# EAGLE design xover (EAGLE 6.4)
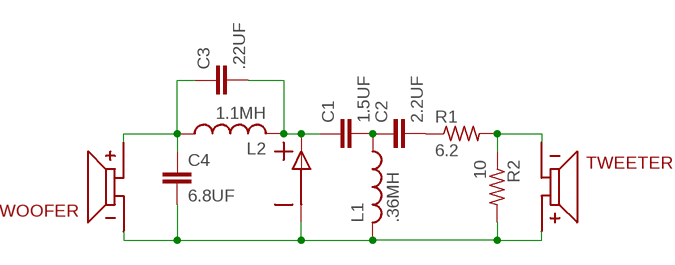
[diagram p0: schematic, sheet 1]

## Parts
C1  1.5UF  [1.5UF]
C2  2.2UF  [2.2UF]
C3  .22UF  [.22UF]
C4  6.8UF  [6.8UF]
INPUT  INPUTREV  [SCREW]
L1  .36MH  .36MHVERTREV  [.36VERT]
L2  1.1MH  1.1MHREV  [1.1MH]
R1  6.2  [6.2]
R2  10  6.210  [6.2]
TWEETER  TWEETER  [SCREW]
WOOFER  TWEETER  [SCREW]

## Nets
N$1: C1.P$1 C3.P$2 INPUT.P$1(PLUS) L2.P$1
N$2: C2.P$2 R1.P$1
N$3: C3.P$1 C4.P$1 L2.P$2 WOOFER.P$2(PLUS)
N$4: R1.P$2 R2.P$1 TWEETER.P$1(MINUS)
N$5: C4.P$2 INPUT.P$2(MINUS) L1.P$1 R2.P$2 TWEETER.P$2(PLUS) WOOFER.P$1(MINUS)
N$7: C1.P$2 C2.P$1 L1.P$2

## Library data of the parts
C1 = xover:1.5UF
C2 = xover:2.2UF
C3 = xover:.22UF
C4 = xover:6.8UF
INPUT = xover:INPUT
L1 = xover:.36MH
L2 = xover:1.1MH
R1 R2 = xover:6.2
TWEETER WOOFER = xover:TWEETER

## Board
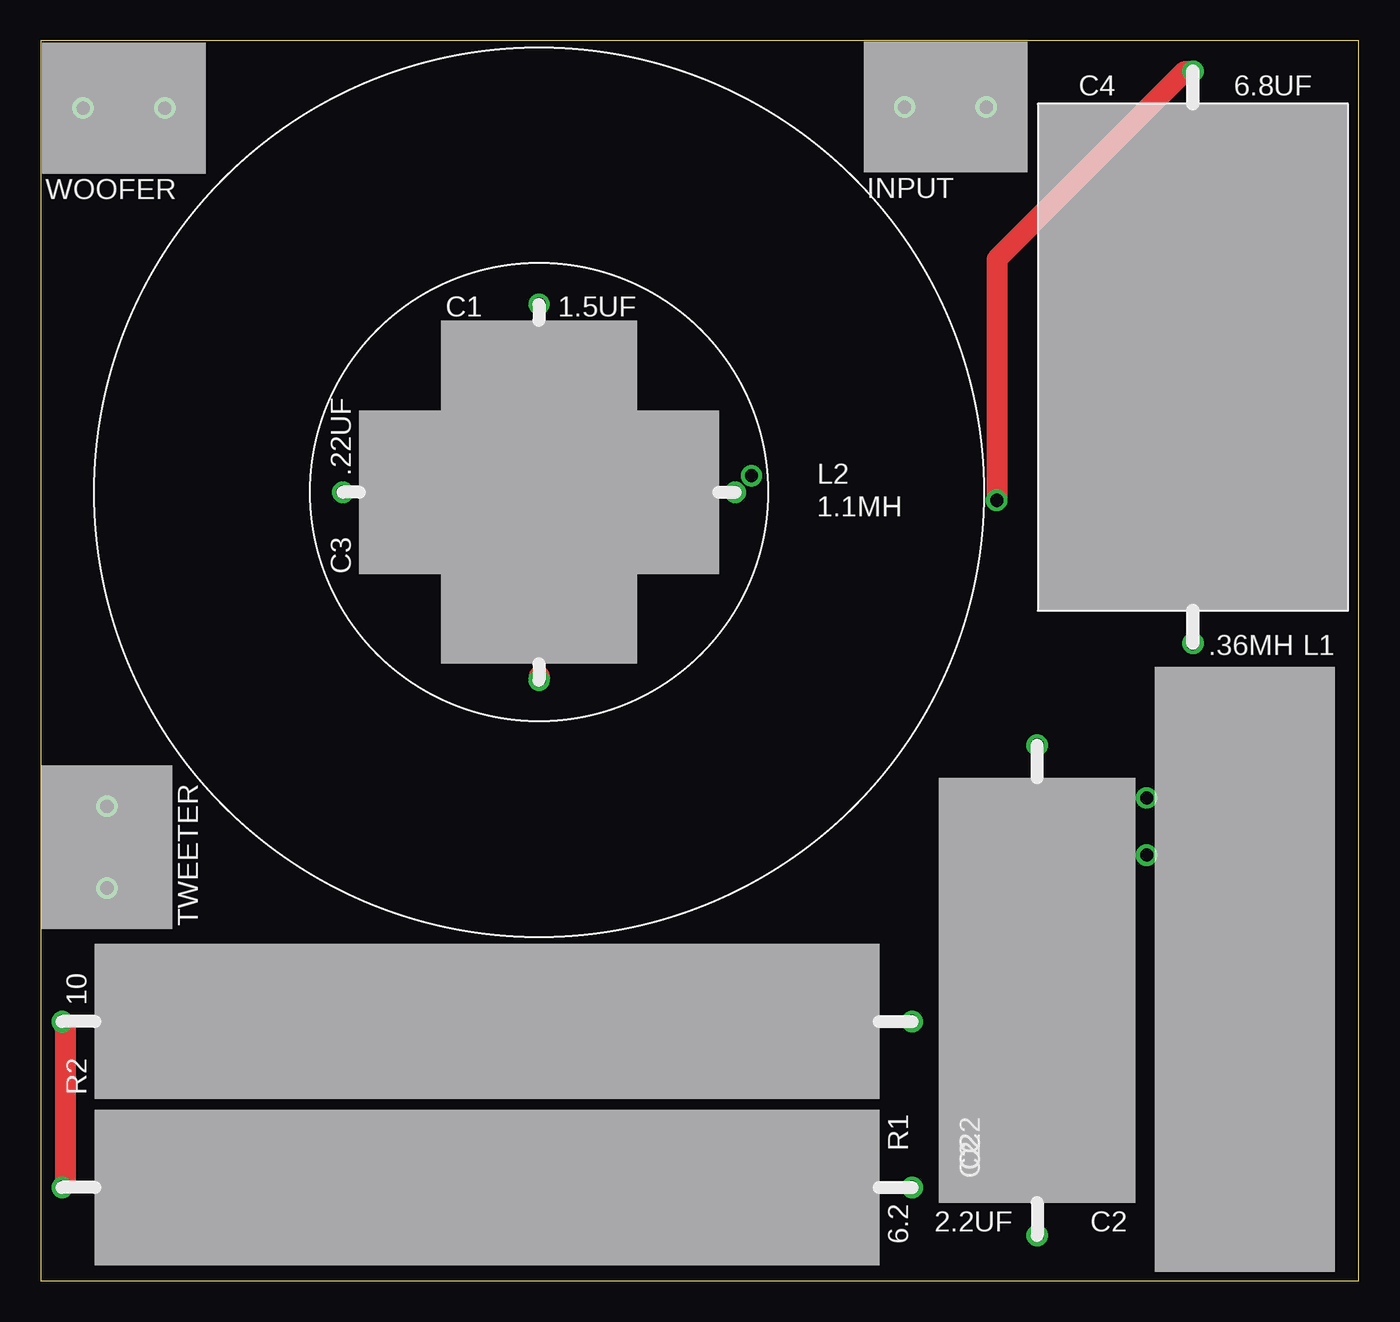
[diagram p1: board, top side]
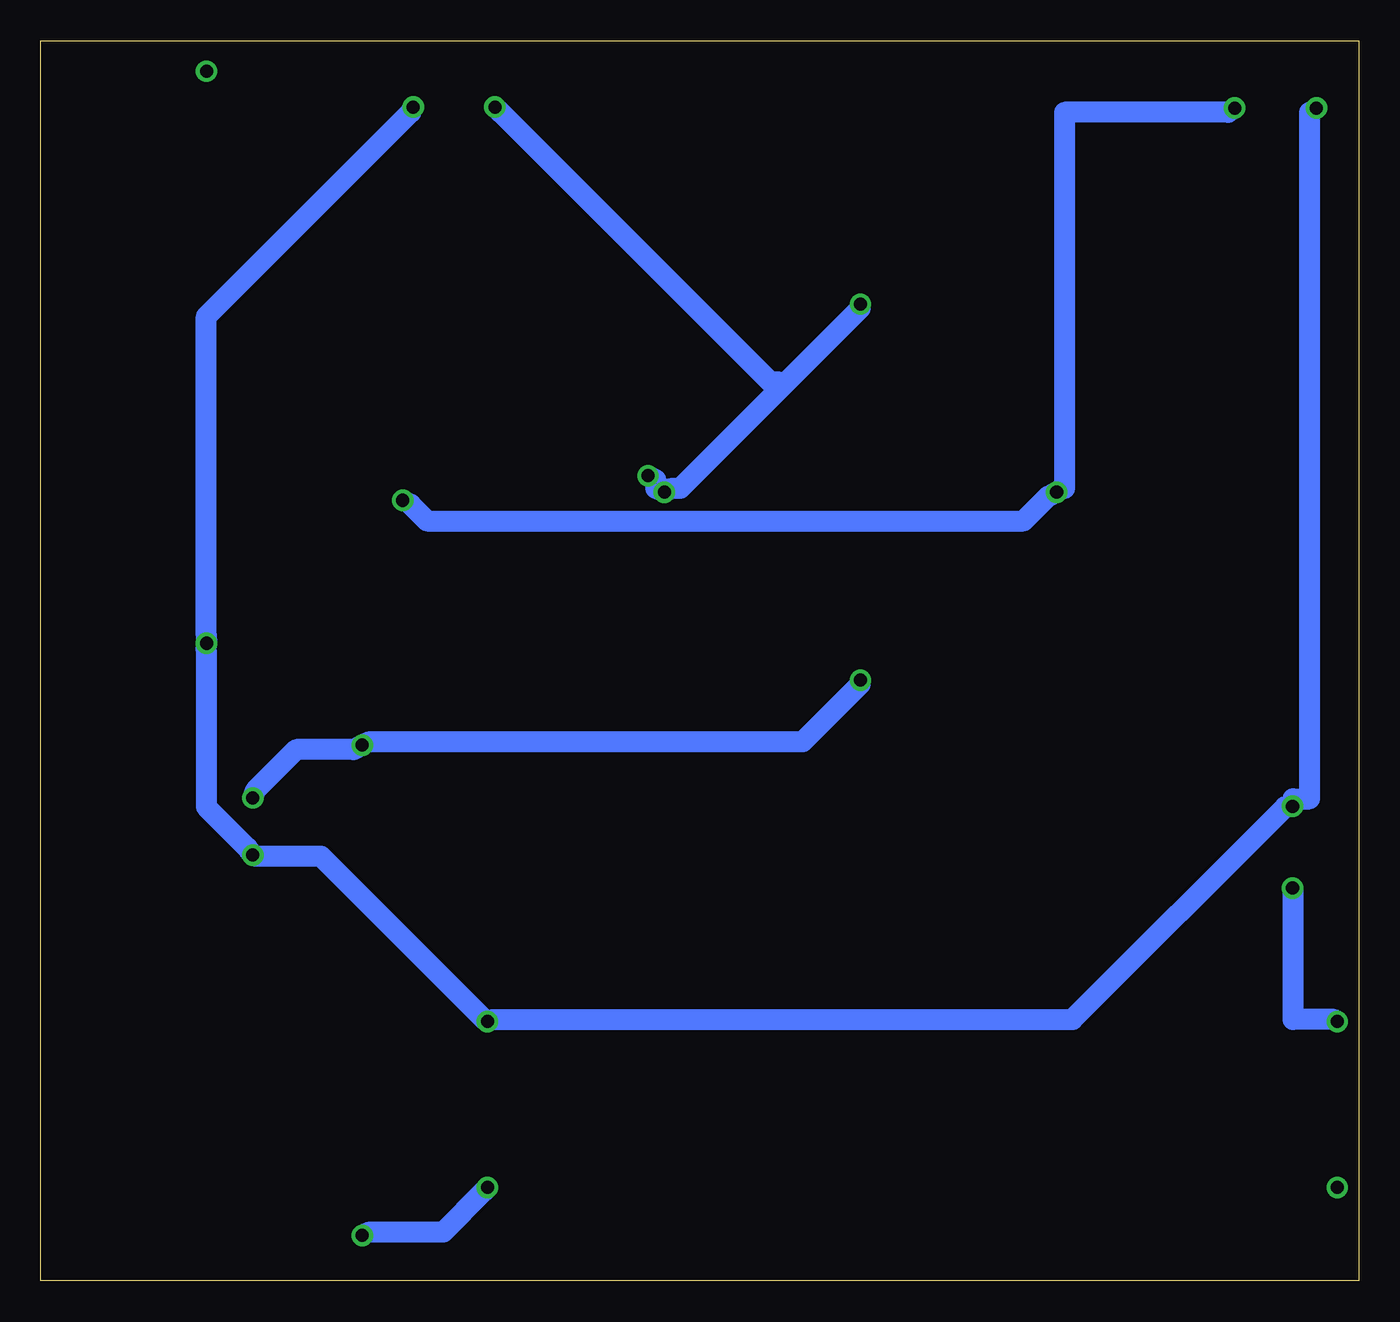
[diagram p2: board, bottom side, seen from below]

Size 80.62 x 75.87 mm. Coordinates in mm from the lower left corner, seen from the top.
Outline: 0,0 80.62,0 80.62,75.87 0,75.87 0,0
Copper layers (1*16): Top 0.035mm / dielectric 1.5mm / Bottom 0.035mm
Design rules "default *": minimum track width 50mil, minimum drill 24mil, track to track 8mil, track to pad 8mil, pad to pad 8mil, via to via 8mil, smd to smd 8mil, copper to edge 0mil, drill to drill 8mil, minimum pad ring 10mil, minimum via ring 8mil, stop-mask expansion 4mil, vias tented up to drill 0mil, thermal gap 10mil

### Footprints (pad centres in the part's own frame; a part is rotated, then mirrored left to right if it is on the bottom)
1.5UF = drill 0.8: P$1 -11.5,0; P$2 11.5,0
2.2UF = drill 0.8: P$1 15,0; P$2 -15,0
.22UF = drill 0.8: P$1 -12,0; P$2 12,0
6.8UF = drill 0.8: P$1 -17.5,0; P$2 17.5,0
SCREW = drill 0.8: P$1 -2.5,0; P$2 2.5,0
.36VERT = drill 0.8: P$1 6,-7; P$2 6,-10.5
1.1MH = drill 0.8: P$1 13,1; P$2 28,-0.5
6.2 = drill 0.8: P$1 -26,0; P$2 26,0

### Placement (x,y rotation side)
C1  30.48,48.26 270 top
C2  60.96,17.78 90 top
C3  30.48,48.26 0 top
C4  70.48,56.52 270 top
INPUT  55.34,71.82 0 top
L1  73.66,19.05 180 top
L2  30.48,48.26 0 top
R1  27.3,5.71 180 top
R2  27.3,15.88 0 top
TWEETER  4.04,26.54 90 top
WOOFER  5.08,71.75 0 top

### Tracks (layer width: path | path; a pad name or v marks a point on that pad's centre or on a via)
N$1
  Bottom 1.27: 35.25,54.75 41.5,48.5 42,48.5 C3.P$2 43,48.5 43,49 L2.P$1 | 35.25,54.75 30.5,59.5 C1.P$1 | INPUT.P$1 52.5,71.5 36,55 35.5,55 35.25,54.75
N$2
  Bottom 1.27: R1.P$1 53.5,5.5 56,3 60.5,3 C2.P$2
N$3
  Top 1.27: L2.P$2 58.5,48 58.5,62.5 70,74 C4.P$1
  Bottom 1.27: WOOFER.P$2 8,71.5 18,71.5 18,48.5 C3.P$1 19,48 20.5,46.5 57,46.5 58,47.5 L2.P$2
N$4
  Top 1.27: R1.P$2 1.5,6 1.5,15.5 R2.P$1
  Bottom 1.27: TWEETER.P$1 4,24 4,16 1.5,16 R2.P$1
N$5
  Bottom 1.27: WOOFER.P$1 3,71.5 3,29.5 4,29.5 TWEETER.P$2 4.5,29 17.5,16 53,16 R2.P$2 53.5,16 63.5,26 67.5,26 L1.P$1 68,26.5 70.5,29 70.5,38.5 C4.P$2 70.5,39.5 70.5,59 58,71.5 INPUT.P$2
N$7
  Top 1.27: 30.5,37 C1.P$2
  Bottom 1.27: C1.P$2 30.5,36.5 34,33 60.5,33 C2.P$1 61.5,32.5 65,32.5 67.5,30 L1.P$2